# Altium schematic sheet USB2514_hubs.SchDoc
size A3
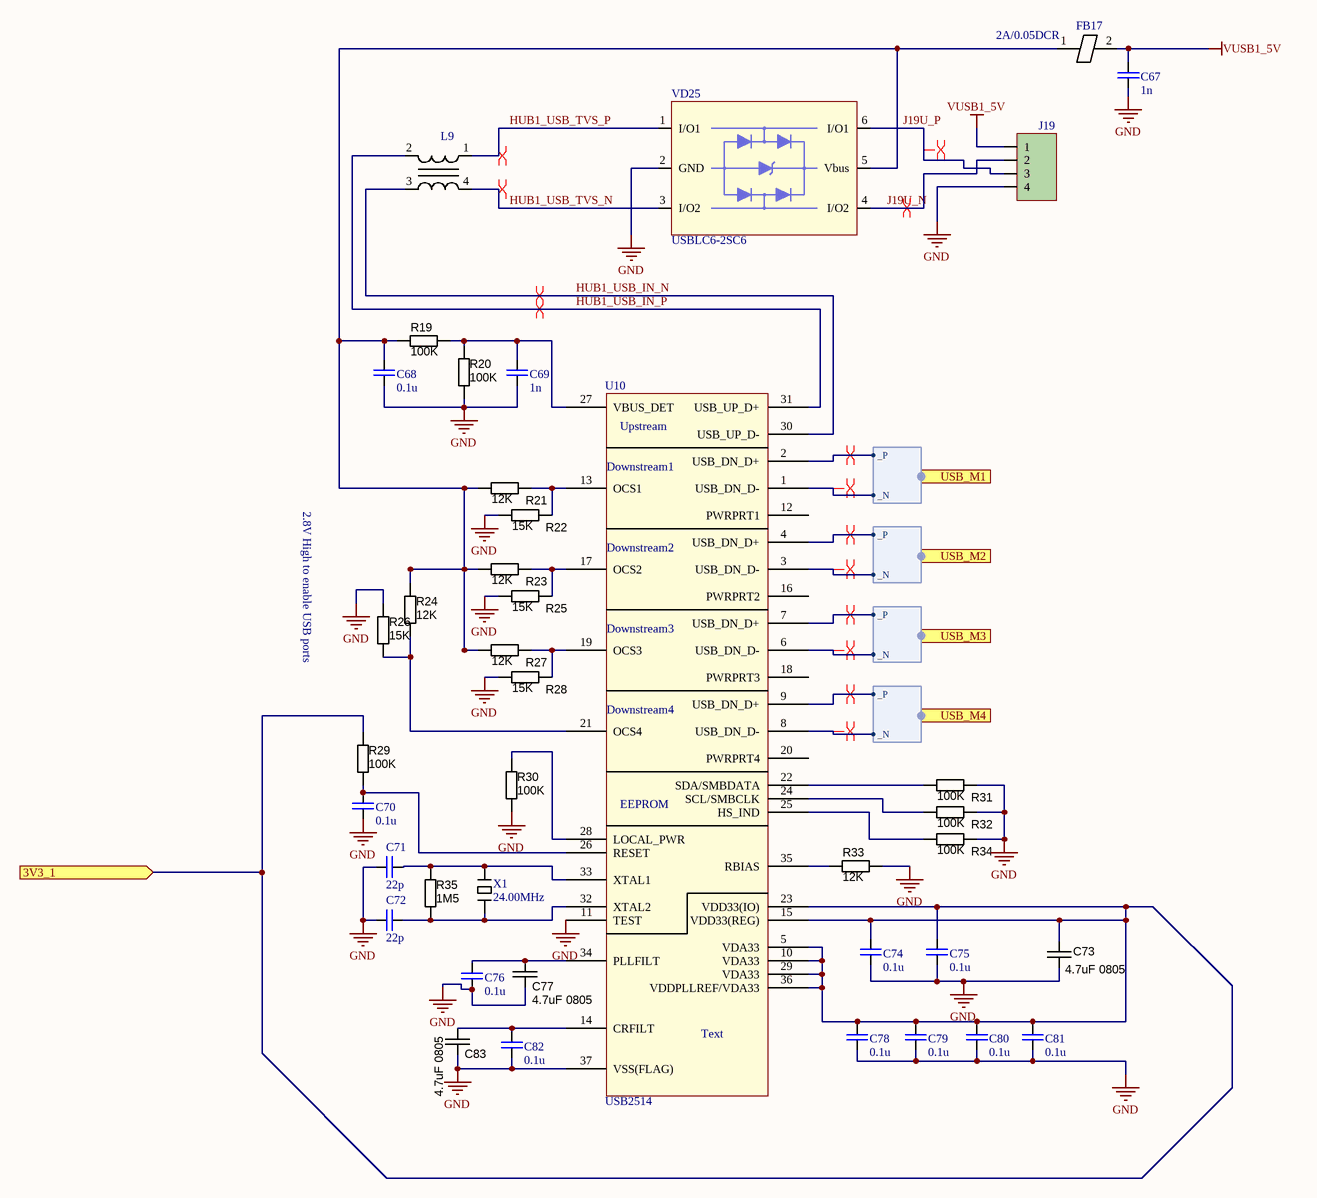
[diagram p0: USB2514_hubs.SchDoc]

## Parts
C67  value 1n  [C0402]  (hidden comment: Конденсатор SMD, 1нФ, X7R, 25В, 10%, 0402)
C68  value 0.1u  [C0402]  (hidden comment: Конденсатор SMD, 0.1мкФ, X7R, 25В, 10%, 0402)
C69  value 1n  [C0402]  (hidden comment: Конденсатор SMD, 1нФ, X7R, 25В, 10%, 0402)
C70  value 0.1u  [C0402]  (hidden comment: Конденсатор SMD, 0.1мкФ, X7R, 25В, 10%, 0402)
C71  value 22p  [C0402]  (hidden comment: Конденсатор SMD, 22пФ, X7R, 50В, 10%, 0402)
C72  value 22p  [C0402]  (hidden comment: Конденсатор SMD, 22пФ, X7R, 50В, 10%, 0402)
C73  value 4.7uF 0805  [CAPC2012X135N]  (hidden comment: approved sub OK)
C74  value 0.1u  [C0402]  (hidden comment: Конденсатор SMD, 0.1мкФ, X7R, 25В, 10%, 0402)
C75  value 0.1u  [C0402]  (hidden comment: Конденсатор SMD, 0.1мкФ, X7R, 25В, 10%, 0402)
C76  value 0.1u  [C0402]  (hidden comment: Конденсатор SMD, 0.1мкФ, X7R, 25В, 10%, 0402)
C77  value 4.7uF 0805  [CAPC2012X135N]  (hidden comment: approved sub OK)
C78  value 0.1u  [C0402]  (hidden comment: Конденсатор SMD, 0.1мкФ, X7R, 25В, 10%, 0402)
C79  value 0.1u  [C0402]  (hidden comment: Конденсатор SMD, 0.1мкФ, X7R, 25В, 10%, 0402)
C80  value 0.1u  [C0402]  (hidden comment: Конденсатор SMD, 0.1мкФ, X7R, 25В, 10%, 0402)
C81  value 0.1u  [C0402]  (hidden comment: Конденсатор SMD, 0.1мкФ, X7R, 25В, 10%, 0402)
C82  value 0.1u  [C0402]  (hidden comment: Конденсатор SMD, 0.1мкФ, X7R, 25В, 10%, 0402)
C83  value 4.7uF 0805  [CAPC2012X135N]  (hidden comment: approved sub OK)
FB17  2A/0.05DCR  [RESC2012X70N]
J19  Разъём (вилка), CWF-4 (DS1069-4 M)  [CWF-4]  (value not drawn)
L9  Inductor ESD (Choke)  [EMI Choke Murata]  (value not drawn)
R19  value 100K  [RESC1005X40N]  (hidden comment: Thick Film)
R20  value 100K  [RESC1005X40N]  (hidden comment: Thick Film)
R21  value 12K  [RESC1005X40N]  (hidden comment: Thick Film)
R22  value 15K  [RESC1005X40N]  (hidden comment: Thick Film)
R23  value 12K  [RESC1005X40N]  (hidden comment: Thick Film)
R24  value 12K  [RESC1005X40N]  (hidden comment: Thick Film)
R25  value 15K  [RESC1005X40N]  (hidden comment: Thick Film)
R26  value 15K  [RESC1005X40N]  (hidden comment: Thick Film)
R27  value 12K  [RESC1005X40N]  (hidden comment: Thick Film)
R28  value 15K  [RESC1005X40N]  (hidden comment: Thick Film)
R29  value 100K  [RESC1005X40N]  (hidden comment: Thick Film)
R30  value 100K  [RESC1005X40N]  (hidden comment: Thick Film)
R31  value 100K  [RESC1005X40N]  (hidden comment: Thick Film)
R32  value 100K  [RESC1005X40N]  (hidden comment: Thick Film)
R33  value 12K  [RESC1005X40N]  (hidden comment: Thick Film)
R34  value 100K  [RESC1005X40N]  (hidden comment: Thick Film)
R35  value 1M5  [RESC1005X40N]  (hidden comment: Thick Film)
U10  USB2514  [USB-2514B 4port Hub]
VD25  TVS Diode  [SOT23-6L]  (value not drawn)
X1  24.00MHz  [Quartz SMD KX-K]

## Ports
3V3_1 (in), USB_M1 (harness DIFF), USB_M2 (harness DIFF), USB_M3 (harness DIFF), USB_M4 (harness DIFF)

## Harnesses
DIFF: _P, _N

## Nets
GND: C67.2 C68.2 C69.2 C70.2 C71.1 C72.1 C73.2 C74.2 C75.2 C76.2 C77.2 C78.2 C79.2 C80.2 C81.2 C82.2 C83.2 J19.4 R20.2 R22.1 R25.1 R26.1 R28.1 R30.2 R31.2 R32.2 R33.2 R34.2 U10.11(TEST) U10.37(VSS(FLAG)) VD25.2(GND)
VUSB1_5V: C67.1 FB17.2 J19.1
3V3_1: C73.1 C74.1 C75.1 C78.1 C79.1 C80.1 C81.1 R29.1 U10.5(VDA33) U10.10(VDA33) U10.15(VDD33(REG)) U10.23(VDD33(IO)) U10.29(VDA33) U10.36(VDDPLLREF/VDA33) ; port 3V3_1
HUB1_USB_IN_N: L9.3 U10.30(USB_UP_D-)
HUB1_USB_IN_P: L9.2 U10.31(USB_UP_D+)
HUB1_USB_TVS_N: L9.4 VD25.3(I/O2)
HUB1_USB_TVS_P: L9.1 VD25.1(I/O1)
J19U_N: J19.2 VD25.4(I/O2)
J19U_P: J19.3 VD25.6(I/O1)
NetC68_1: C68.1 FB17.1 R19.1 R21.1 R23.1 R24.1 R27.1 VD25.5(Vbus)
NetC69_1: C69.1 R19.2 R20.1 U10.27(VBUS_DET)
NetC70_1: C70.1 R29.2 U10.26(RESET)
NetC71_2: C71.2 R35.1 U10.33(XTAL1) X1.2
NetC72_2: C72.2 R35.2 U10.32(XTAL2) X1.1
NetC76_1: C76.1 C77.1 U10.34(PLLFILT)
NetC82_1: C82.1 C83.1 U10.14(CRFILT)
NetR21_2: R21.2 R22.2 U10.13(OCS1)
NetR23_2: R23.2 R25.2 U10.17(OCS2)
NetR24_2: R24.2 R26.2 U10.21(OCS4)
NetR27_2: R27.2 R28.2 U10.19(OCS3)
NetR30_1: R30.1 U10.28(LOCAL_PWR)
NetR31_1: R31.1 U10.22(SDA/SMBDATA)
NetR32_1: R32.1 U10.24(SCL/SMBCLK)
NetR33_1: R33.1 U10.35(RBIAS)
NetR34_1: R34.1 U10.25(HS_IND)
NetU10_1: U10.1(USB_DN_D-) ; port USB_M1._N
NetU10_2: U10.2(USB_DN_D+) ; port USB_M1._P
NetU10_3: U10.3(USB_DN_D-) ; port USB_M2._N
NetU10_4: U10.4(USB_DN_D+) ; port USB_M2._P
NetU10_6: U10.6(USB_DN_D-) ; port USB_M3._N
NetU10_7: U10.7(USB_DN_D+) ; port USB_M3._P
NetU10_8: U10.8(USB_DN_D-) ; port USB_M4._N
NetU10_9: U10.9(USB_DN_D+) ; port USB_M4._P

Not connected (* = marked no-connect by the designer): U10 12(PWRPRT1) 16(PWRPRT2) 18(PWRPRT3) 20(PWRPRT4)

## Layout directives
differential pair: HUB1_USB_IN_N, HUB1_USB_IN_P, HUB1_USB_TVS_N, HUB1_USB_TVS_P, J19U_N, J19U_P, NetU10_1, NetU10_2, NetU10_3, NetU10_4, NetU10_6, NetU10_7, NetU10_8, NetU10_9

## Notes on the sheet
- 2.8V High to enable USB ports
- (in symbol SMSC USB2514) Upstream; Downstream1; Downstream2; Downstream3; Downstream4; EEPROM; Text

## Library data of the parts
C67 C69 = C0402: Chip Capacitor 0402; Assembly: 1n_X7R_25V_10%_0402; Voltage_assembly: 25V; Tolerance: 10%; Voltage: 25В; TemperatureCoeff: X7R; Family: Конденсатор SMD; Capacitance: 1нФ; Package: 0402
C68 C70 C74-C76 C78-C82 = C0402: Chip Capacitor 0402; Assembly: 0.1u_X7R_25V_10%_0402; Voltage_assembly: 25V; Tolerance: 10%; Voltage: 25В; TemperatureCoeff: X7R; Family: Конденсатор SMD; Capacitance: 0.1мкФ; Package: 0402
C71 C72 = C0402: Chip Capacitor 0402; Assembly: 22p_X7R_50V_10%_0402; Voltage_assembly: 50V; Tolerance: 10%; Voltage: 50В; TemperatureCoeff: X7R; Family: Конденсатор SMD; Capacitance: 22пФ; Package: 0402
C73 C77 C83 = CAPC_4u7_0805: Capacitor SMD Cer 4.7uF 10% 16V X5R 0805; Manufacturer 1: Taiyo Yuden; Manufacturer Part Number 1: EMK212BJ475KG-T; Ratings: 16V; X5R; Material: ceramic; SCDType: spec; Package / Case: 0805 (2012 Metric); Tolerance: ±10%; Supplier 1: Digi-Key; Supplier Part Number 1: 587-1294-1-ND; Operating Temperature: -55°C ~ 85°C; Size / Dimension: 0.079" L x 0.049" W (2.00mm x 1.25mm); Thickness (Max): 0.053" (1.35mm); ComponentLink1URL: http://www.yuden.co.jp/productdata/catalog/en/mlcc01_e.pdf; ComponentLink1Description: http://www.yuden.co.jp/productdata/catalog/en/mlcc01_e.pdf; Supplier 2: Digi-Key; Supplier Part Number 2: 1276-1065-1-ND; Manufacturer 2: Samsung Electro-Mechanics America, Inc; Manufacturer Part Number 2: CL21A475KOFNNNE; RoHS 2: RoHS Compliant; ComponentLink2URL: http://www.samsungsem.com/servlet/FileDownload?type=spec&file=CL21A475KOFNNNE.pdf; ComponentLink2Description: http://www.samsungsem.com/servlet/FileDownload?type=spec&file=CL21A475KOFNNNE.pdf; Supplier 3: Digi-Key; Supplier Part Number 3: 399-8101-1-ND; Manufacturer 3: Kemet; Manufacturer Part Number 3: C0805C475K4PACTU; RoHS 3: RoHS Compliant; ComponentLink3URL: http://capacitoredge.kemet.com/capedge2/DataSheet?pn=C0805C475K4PACTU; ComponentLink3Description: http://capacitoredge.kemet.com/capedge2/DataSheet?pn=C0805C475K4PACTU; Supplier 4: Digi-Key; Supplier Part Number 4: 490-7215-1-ND; Manufacturer 4: Murata Electronics North America; Manufacturer Part Number 4: GRM21BR61C475MA88L; RoHS 4: RoHS Compliant; ComponentLink4URL: http://psearch.murata.com/capacitor/product/GRM21BR61C475MA88#.pdf; ComponentLink4Description: http://psearch.murata.com/capacitor/product/GRM21BR61C475MA88#.pdf; Supplier 5: Digi-Key; Supplier Part Number 5: 445-7640-1-ND; Manufacturer 5: TDK Corporation; Manufacturer Part Number 5: C2012X5R1C475K125AC; RoHS 5: RoHS Compliant; ComponentLink5URL: http://product.tdk.com/capacitor/mlcc/en/documents/mlcc_commercial_general_en.pdf; ComponentLink5Description: http://product.tdk.com/capacitor/mlcc/en/documents/mlcc_commercial_general_en.pdf; RoHS 1: RoHS Compliant
FB17 = Ferrite Bead 2A/0.05DCR
J19 = CWF-4: 4-pin male though-hole connector, pitch 2.5 mm; Manufacturer: Confly (China); Family: Разъём (вилка); PartNumber: CWF-4 (DS1069-4 M); Assembly: CWF-4; Value: CWF-4
L9 = Inductor ESD (Choke): DLW21HN900SQ2L
R19 R20 R29 R30 = RES_100K_0402_5%: Resistor SMD chip 100k Ohm 0.063W 5% 0402; Manufacturer 1: Vishay Dale; Manufacturer Part Number 1: CRCW0402100KJNED; Ratings: 1/16 W; SCDType: undef; Package / Case: 0402 (1005 Metric); Tolerance: ±5%; ComponentLink2URL: http://www.yageo.com/documents/recent/PYu-RC0402_51_RoHS_L_6.pdf; ComponentLink2Description: http://www.yageo.com/documents/recent/PYu-RC0402_51_RoHS_L_6.pdf; Supplier 1: Digi-Key; Supplier Part Number 1: 541-100KJCT-ND; ComponentLink1URL: http://www.vishay.com/doc?20035; ComponentLink1Description: http://www.vishay.com/doc?20035; Supplier 2: Digi-Key; Supplier Part Number 2: 311-100KJRCT-ND; Manufacturer 2: Yageo; Manufacturer Part Number 2: RC0402JR-07100KL
R21-R28 R31-R34 = RES_1K_0402_5%: Resistor SMD chip 1k Ohm 0.063W 5% 0402; Manufacturer 1: Yageo; Manufacturer Part Number 1: RC0402JR-071KL; Ratings: 1/16 W; SCDType: spec; Package / Case: 0402 (1005 Metric); Tolerance: ±5%; Supplier 1: Digi-Key; Supplier Part Number 1: 311-1.0KJRCT-ND; RoHS 1: RoHS Compliant; ComponentLink1URL: http://www.yageo.com/documents/recent/PYu-RC0402_51_RoHS_L_6.pdf; ComponentLink1Description: http://www.yageo.com/documents/recent/PYu-RC0402_51_RoHS_L_6.pdf; Supplier 2: Digi-Key; Supplier Part Number 2: 541-1.0KJCT-ND; Manufacturer 2: Vishay Dale; Manufacturer Part Number 2: CRCW04021K00JNED; RoHS 2: RoHS Compliant; ComponentLink2URL: http://www.vishay.com/doc?20035; ComponentLink2Description: http://www.vishay.com/doc?20035; Supplier 3: Digi-Key; Supplier Part Number 3: 1276-4376-1-ND; Manufacturer 3: Samsung Electro-Mechanics America, Inc; Manufacturer Part Number 3: RC1005J102CS; RoHS 3: RoHS Compliant; ComponentLink3URL: http://www.samsungsem.com/servlet/FileDownload?filename=productcatalog/pdf/Chip_Resistor.pdf; ComponentLink3Description: http://www.samsungsem.com/servlet/FileDownload?filename=productcatalog/pdf/Chip_Resistor.pdf; Supplier 4: Digi-Key; Supplier Part Number 4: RHM1.0KCECT-ND; Manufacturer 4: Rohm Semiconductor; Manufacturer Part Number 4: MCR01MRTJ102; RoHS 4: RoHS Compliant; ComponentLink4URL: http://rohmfs.rohm.com/en/products/databook/datasheet/passive/resistor/chip_resistor/mcr_g.pdf; ComponentLink4Description: http://rohmfs.rohm.com/en/products/databook/datasheet/passive/resistor/chip_resistor/mcr_g.pdf; Supplier 5: Digi-Key; Supplier Part Number 5: P1.0KJCT-ND; Manufacturer 5: Panasonic Electronic Components; Manufacturer Part Number 5: ERJ-2GEJ102X; RoHS 5: RoHS Compliant; ComponentLink5URL: http://industrial.panasonic.com/www-cgi/jvcr13pz.cgi?E+PZ+3+AOA0001+ERJ2GEJ102X+7+WW; ComponentLink5Description: http://industrial.panasonic.com/www-cgi/jvcr13pz.cgi?E+PZ+3+AOA0001+ERJ2GEJ102X+7+WW
R35 = RES_1M_0402_5%: Resistor SMD chip 1M Ohm 0.063W 5% 0402; Manufacturer 1: Vishay Dale; Manufacturer Part Number 1: CRCW04021M00JNED; Ratings: 1/16 W; Power Rating: 0.063W, 1/16W; SCDType: spec; Package / Case: 0402 (1005 Metric); Tolerance: ±5%; Material: Thick Film; Manufacturer 2: Yageo; Manufacturer Part Number 2: RC0402JR-071ML; Supplier 1: Digi-Key; Supplier Part Number 1: 541-1.0MJCT-ND; ComponentLink1URL: http://www.vishay.com/doc?20035; ComponentLink1Description: http://www.vishay.com/doc?20035; Supplier 2: Digi-Key; Supplier Part Number 2: 311-1.0MJRCT-ND; ComponentLink2URL: http://www.yageo.com/documents/recent/PYu-RC0402_51_RoHS_L_6.pdf; ComponentLink2Description: http://www.yageo.com/documents/recent/PYu-RC0402_51_RoHS_L_6.pdf
U10 = SMSC USB2514: type: USB2514
VD25 = USBLC6-2SC6: Very low capacitance ESD protection; Manufacturer: STMicroelectronics; Part Number: USBLC6-2SC6
X1 = Quartz: Quartz KX-K